# Altium schematic sheet drivermotor.SchDoc
size A
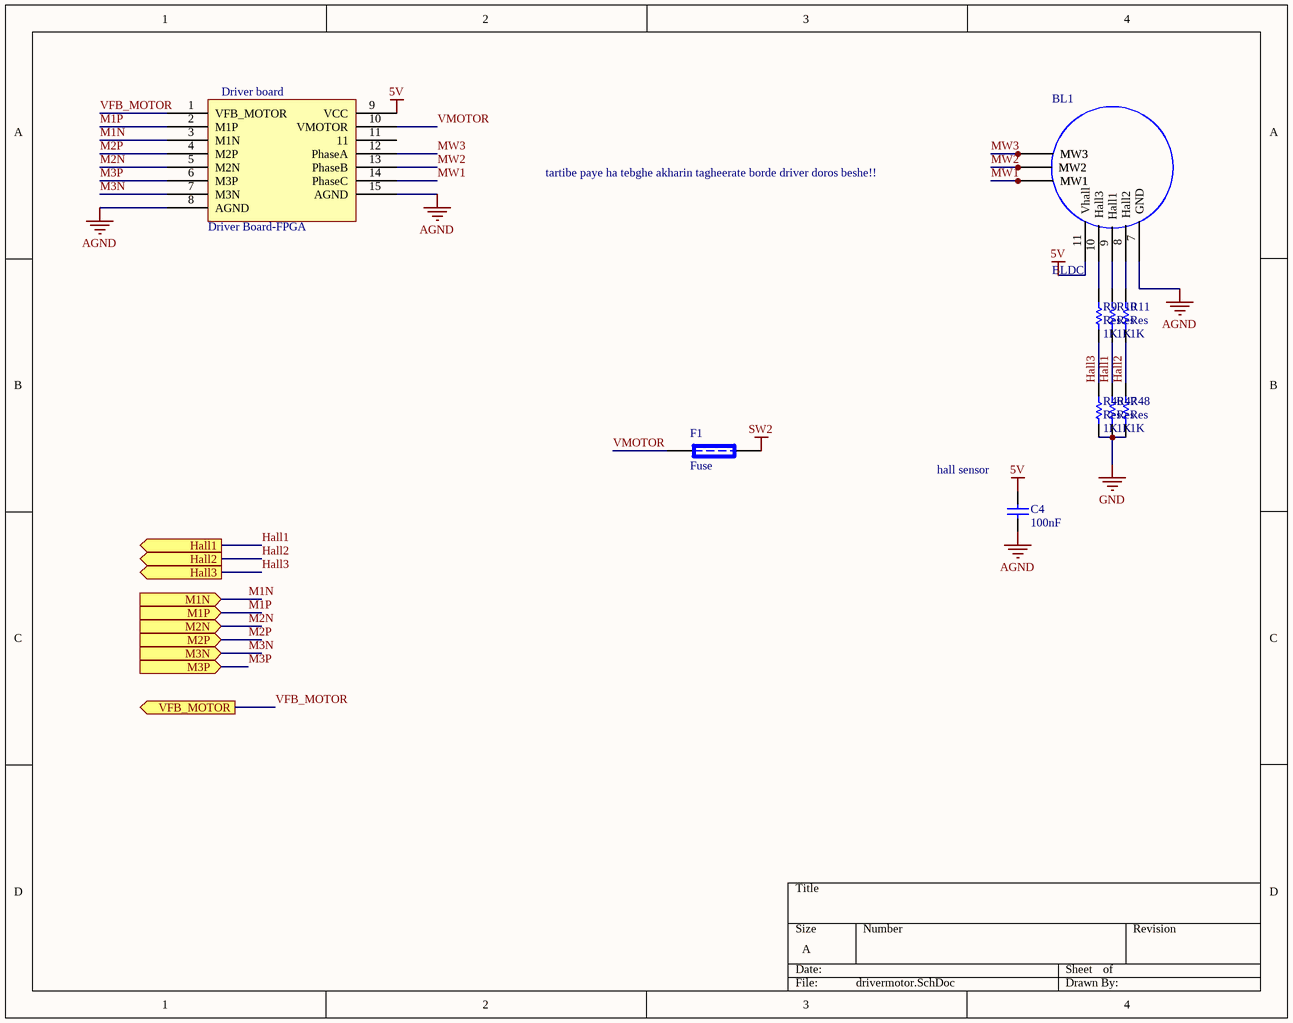
[diagram p0: drivermotor.SchDoc]

## Parts
?  Driver Board-FPGA  [Driver Board-FPGA]
BL1  BLDC  [FLT11]
C4  value 100nF  [2012[0805]]  (hidden comment: Cap_UP)
F1  Fuse  [fuse kh]
R9  Res  value 1K  [2012[0805]]
R10  Res  value 1K  [2012[0805]]
R11  Res  value 1K  [2012[0805]]
R46  Res  value 1K  [2012[0805]]
R47  Res  value 1K  [2012[0805]]
R48  Res  value 1K  [2012[0805]]

## Ports
Hall1 (out), Hall2 (out), Hall3 (out), M1N (in), M1P (in), M2N (in), M2P (in), M3N (in), M3P (in), VFB_MOTOR (out)

## Nets
5V: ?.9(VCC) BL1.11(Vhall) C4.2
AGND: ?.8(AGND) ?.15(AGND) BL1.7(GND) C4.1
GND: R46.1 R47.1 R48.1
SW2: F1.2
Hall1: R10.1 R47.2 ; port Hall1
Hall2: R11.1 R48.2 ; port Hall2
Hall3: R9.1 R46.2 ; port Hall3
M1N: ?.3(M1N) ; port M1N
M1P: ?.2(M1P) ; port M1P
M2N: ?.5(M2N) ; port M2N
M2P: ?.4(M2P) ; port M2P
M3N: ?.7(M3N) ; port M3N
M3P: ?.6(M3P) ; port M3P
MW1: ?.14(PhaseC) BL1.1(MW1) BL1.2(MW1)
MW2: ?.13(PhaseB) BL1.3(MW2) BL1.4(MW2)
MW3: ?.12(PhaseA) BL1.5(MW3) BL1.6(MW3)
VFB_MOTOR: ?.1(VFB_MOTOR) ; port VFB_MOTOR
VMOTOR: ?.10(VMOTOR) F1.1
NetBL1_8: BL1.8(Hall2) R11.2
NetBL1_9: BL1.9(Hall1) R10.2
NetBL1_10: BL1.10(Hall3) R9.2

Not connected (* = marked no-connect by the designer): ? 11

## Notes on the sheet
- tartibe paye ha tebghe akharin tagheerate borde driver doros beshe!!
- (near C4) hall sensor
- (in symbol Driver Board-FPGA) Driver board

## Library data of the parts
C4 = Cap_UP: Capacitor; Published: 8-Jun-2000; LatestRevisionDate: 17-Jul-2002; LatestRevisionNote: Re-released for DXP Platform.; PackageReference: RAD-0.3; Publisher: Altium Limited
R9-R11 R46-R48 = Res: Semiconductor Resistor; Published: 8-Jun-2000; LatestRevisionDate: 17-Jul-2002; LatestRevisionNote: Re-released for DXP Platform.; PackageReference: AXIAL-0.5; Publisher: Altium Limited
F1 = Fuse: Published: 8-Jun-2000; LatestRevisionDate: 17-Jul-2002; LatestRevisionNote: Re-released for DXP Platform.; PackageReference: PIN-W2/E2.8; Publisher: Altium Limited